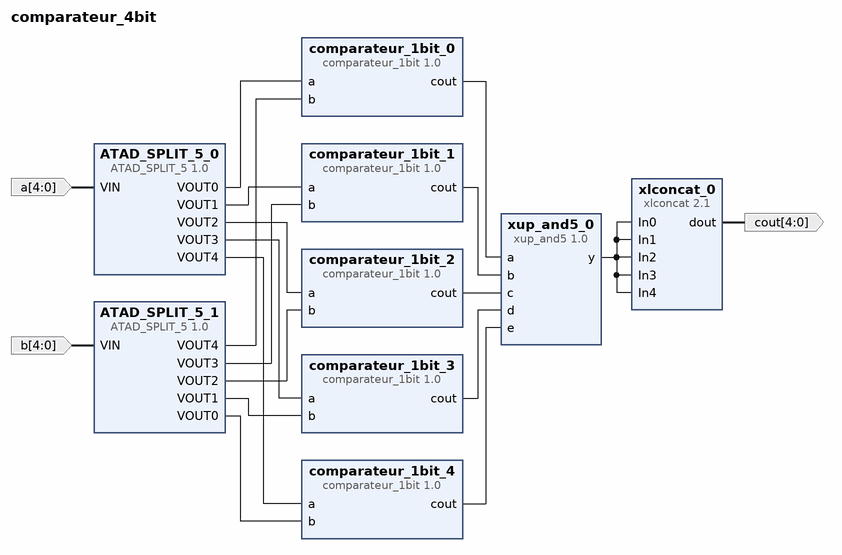
[diagram p0: block diagram of the top level]
# Vivado block design comparateur_4bit, xc7a100tcsg324-1, Vivado 2018.3
create_bd_design comparateur_4bit

create_bd_port -dir I -from 4 -to 0 a
create_bd_port -dir I -from 4 -to 0 b
create_bd_port -dir O -from 4 -to 0 cout

create_bd_cell -type ip -vlnv xilinx.com:user:ATAD_SPLIT_5:1.0 ATAD_SPLIT_5_0
create_bd_cell -type ip -vlnv xilinx.com:user:ATAD_SPLIT_5:1.0 ATAD_SPLIT_5_1
create_bd_cell -type ip -vlnv polymtl.ca:user:comparateur_1bit:1.0 comparateur_1bit_0
create_bd_cell -type ip -vlnv polymtl.ca:user:comparateur_1bit:1.0 comparateur_1bit_1
create_bd_cell -type ip -vlnv polymtl.ca:user:comparateur_1bit:1.0 comparateur_1bit_2
create_bd_cell -type ip -vlnv polymtl.ca:user:comparateur_1bit:1.0 comparateur_1bit_3
create_bd_cell -type ip -vlnv polymtl.ca:user:comparateur_1bit:1.0 comparateur_1bit_4
create_bd_cell -type ip -vlnv xilinx.com:xup:xup_and5:1.0 xup_and5_0
create_bd_cell -type ip -vlnv xilinx.com:ip:xlconcat:2.1 xlconcat_0
set_property -dict {CONFIG.NUM_PORTS 5} [get_bd_cells xlconcat_0]

# ---- connections ----

connect_bd_net [get_bd_ports b] [get_bd_pins ATAD_SPLIT_5_1/VIN]
connect_bd_net [get_bd_ports a] [get_bd_pins ATAD_SPLIT_5_0/VIN]
connect_bd_net [get_bd_pins ATAD_SPLIT_5_0/VOUT0] [get_bd_pins comparateur_1bit_0/a]
connect_bd_net [get_bd_pins ATAD_SPLIT_5_1/VOUT4] [get_bd_pins comparateur_1bit_0/b]
connect_bd_net [get_bd_pins ATAD_SPLIT_5_0/VOUT1] [get_bd_pins comparateur_1bit_1/a]
connect_bd_net [get_bd_pins ATAD_SPLIT_5_1/VOUT3] [get_bd_pins comparateur_1bit_1/b]
connect_bd_net [get_bd_pins ATAD_SPLIT_5_0/VOUT2] [get_bd_pins comparateur_1bit_2/a]
connect_bd_net [get_bd_pins ATAD_SPLIT_5_1/VOUT2] [get_bd_pins comparateur_1bit_2/b]
connect_bd_net [get_bd_pins ATAD_SPLIT_5_0/VOUT3] [get_bd_pins comparateur_1bit_3/a]
connect_bd_net [get_bd_pins ATAD_SPLIT_5_1/VOUT1] [get_bd_pins comparateur_1bit_3/b]
connect_bd_net [get_bd_pins ATAD_SPLIT_5_0/VOUT4] [get_bd_pins comparateur_1bit_4/a]
connect_bd_net [get_bd_pins ATAD_SPLIT_5_1/VOUT0] [get_bd_pins comparateur_1bit_4/b]
connect_bd_net [get_bd_pins comparateur_1bit_0/cout] [get_bd_pins xup_and5_0/a]
connect_bd_net [get_bd_pins comparateur_1bit_1/cout] [get_bd_pins xup_and5_0/b]
connect_bd_net [get_bd_pins comparateur_1bit_2/cout] [get_bd_pins xup_and5_0/c]
connect_bd_net [get_bd_pins comparateur_1bit_3/cout] [get_bd_pins xup_and5_0/d]
connect_bd_net [get_bd_pins comparateur_1bit_4/cout] [get_bd_pins xup_and5_0/e]
connect_bd_net [get_bd_pins xup_and5_0/y] \
  [get_bd_pins xlconcat_0/In0] [get_bd_pins xlconcat_0/In1] [get_bd_pins xlconcat_0/In2] [get_bd_pins xlconcat_0/In3] \
  [get_bd_pins xlconcat_0/In4]
connect_bd_net [get_bd_pins xlconcat_0/dout] [get_bd_ports cout]

validate_bd_design
save_bd_design
